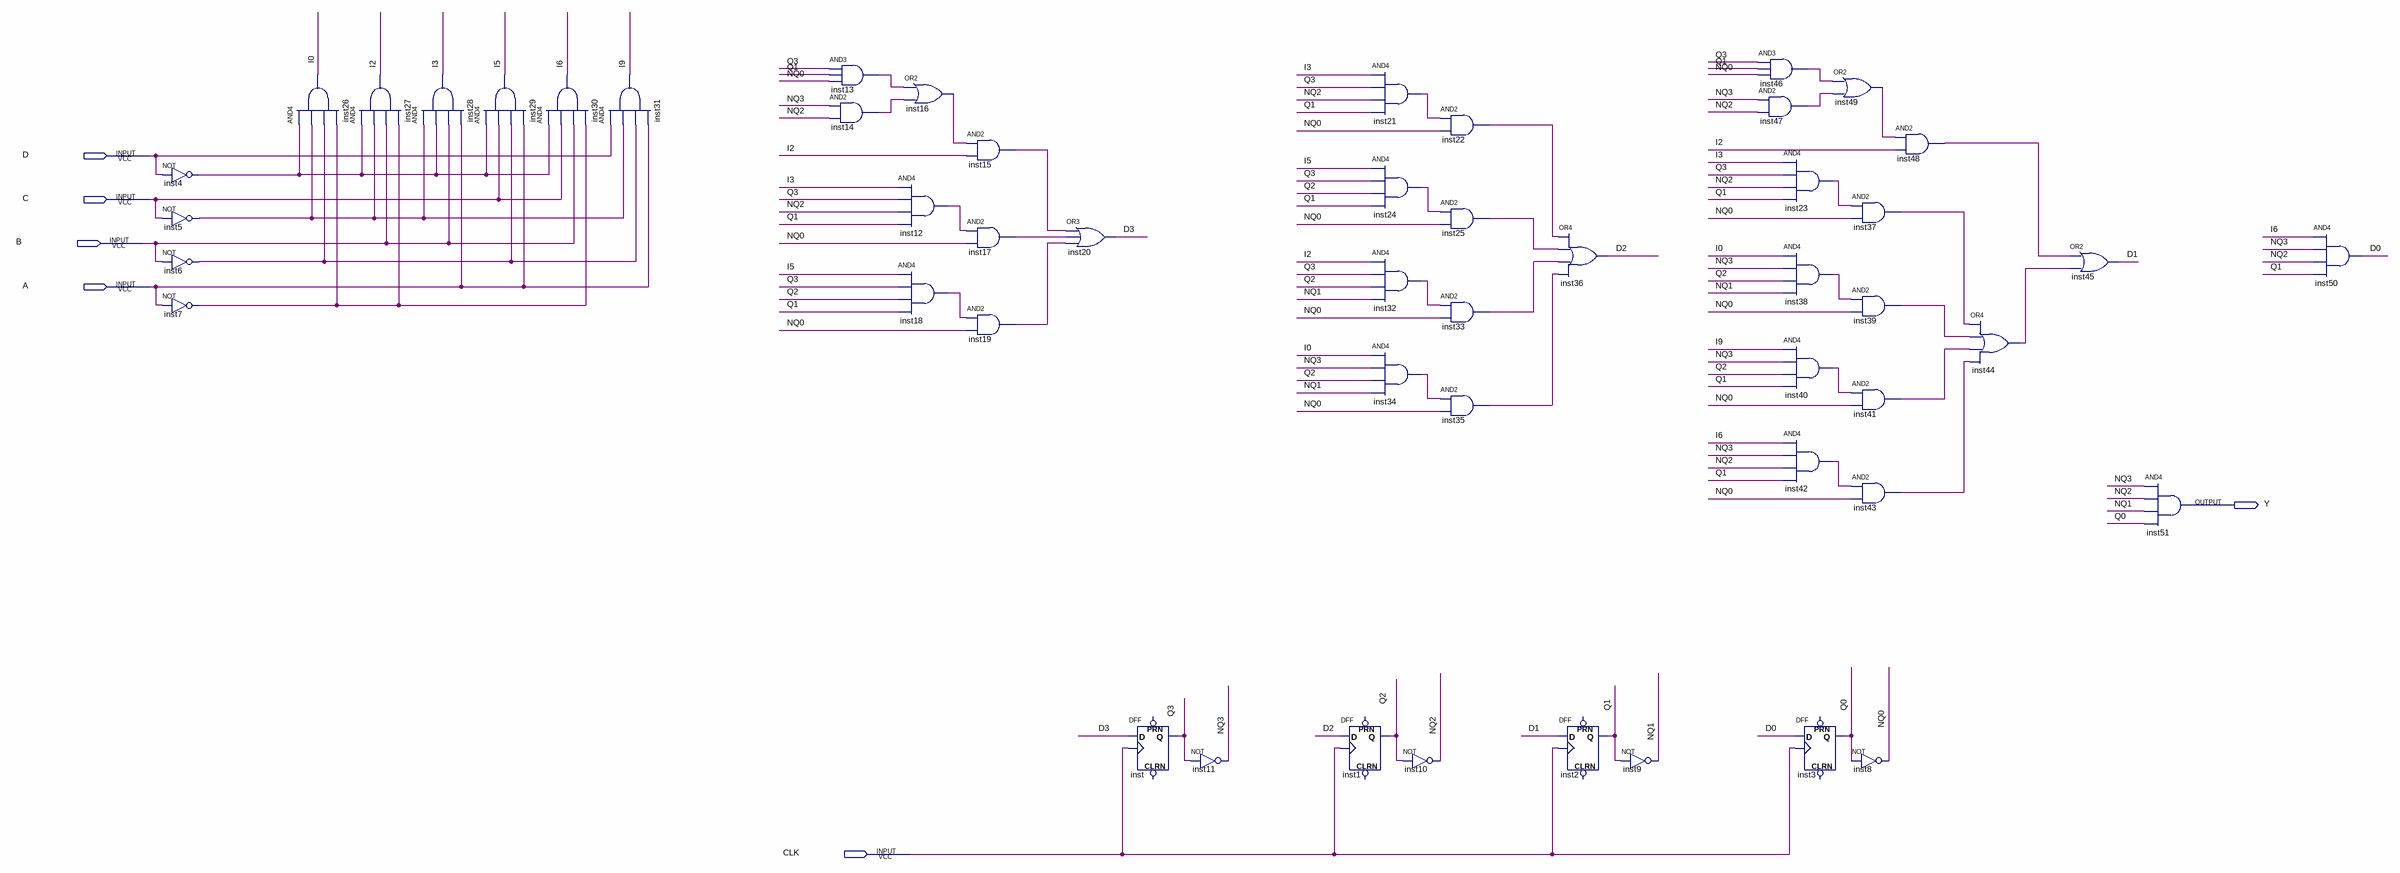
[diagram p0: schematic sheet]
// Quartus schematic MSSV.bdf as structural Verilog: 52 symbols, 6 pins
module MSSV (
  input  D,
  input  C,
  input  B,
  input  A,
  input  CLK,
  output Y
);

  wire D0, D1, D2, D3, I0, I2, I3, I5, I6, I9, inst4_out, inst5_out, inst6_out, inst7_out, inst12_out,
       inst13_out, inst14_out, inst15_out, inst16_out, inst17_out, inst18_out, inst19_out, inst21_out,
       inst22_out, inst23_out, inst24_out, inst25_out, inst32_out, inst33_out, inst34_out, inst35_out,
       inst37_out, inst38_out, inst39_out, inst40_out, inst41_out, inst42_out, inst43_out, inst44_out,
       inst46_out, inst47_out, inst48_out, inst49_out, NQ0, NQ1, NQ2, NQ3, Q0, Q1, Q2, Q3;

  not inst4 (inst4_out, D);
  not inst5 (inst5_out, C);
  not inst6 (inst6_out, B);
  not inst7 (inst7_out, A);
  and inst26 (I0, inst4_out, inst5_out, inst6_out, inst7_out);
  and inst27 (I2, inst4_out, inst5_out, B, inst7_out);
  and inst28 (I3, inst5_out, inst4_out, B, A);
  and inst29 (I5, inst4_out, C, inst6_out, A);
  and inst30 (I6, inst4_out, C, B, inst7_out);
  and inst31 (I9, D, inst5_out, inst6_out, A);
  and inst13 (inst13_out, Q3, Q1, NQ0);
  and inst14 (inst14_out, NQ3, NQ2);
  or inst16 (inst16_out, inst13_out, inst14_out);
  and inst12 (inst12_out, I3, Q3, NQ2, Q1);
  and inst18 (inst18_out, I5, Q3, Q2, Q1);
  and inst15 (inst15_out, inst16_out, I2);
  and inst17 (inst17_out, inst12_out, NQ0);
  and inst19 (inst19_out, inst18_out, NQ0);
  or inst20 (D3, inst15_out, inst17_out, inst19_out);
  DFF inst (.CLK(CLK), .D(D3), .Q(Q3));  // open: CLRN, PRN
  not inst11 (NQ3, Q3);
  DFF inst1 (.CLK(CLK), .D(D2), .Q(Q2));  // open: CLRN, PRN
  and inst21 (inst21_out, I3, Q3, NQ2, Q1);
  and inst24 (inst24_out, I5, Q3, Q2, Q1);
  and inst32 (inst32_out, I2, Q3, Q2, NQ1);
  and inst34 (inst34_out, I0, NQ3, Q2, NQ1);
  not inst10 (NQ2, Q2);
  and inst22 (inst22_out, inst21_out, NQ0);
  and inst25 (inst25_out, inst24_out, NQ0);
  and inst33 (inst33_out, inst32_out, NQ0);
  and inst35 (inst35_out, inst34_out, NQ0);
  or inst36 (D2, inst22_out, inst25_out, inst33_out, inst35_out);
  DFF inst2 (.CLK(CLK), .D(D1), .Q(Q1));  // open: CLRN, PRN
  not inst9 (NQ1, Q1);
  and inst46 (inst46_out, Q3, Q1, NQ0);
  and inst47 (inst47_out, NQ3, NQ2);
  and inst23 (inst23_out, I3, Q3, NQ2, Q1);
  and inst38 (inst38_out, I0, NQ3, Q2, NQ1);
  and inst40 (inst40_out, I9, NQ3, Q2, Q1);
  and inst42 (inst42_out, I6, NQ3, NQ2, Q1);
  DFF inst3 (.CLK(CLK), .D(D0), .Q(Q0));  // open: CLRN, PRN
  or inst49 (inst49_out, inst46_out, inst47_out);
  and inst37 (inst37_out, inst23_out, NQ0);
  and inst39 (inst39_out, inst38_out, NQ0);
  and inst41 (inst41_out, inst40_out, NQ0);
  and inst43 (inst43_out, inst42_out, NQ0);
  not inst8 (NQ0, Q0);
  and inst48 (inst48_out, inst49_out, I2);
  or inst44 (inst44_out, inst37_out, inst39_out, inst41_out, inst43_out);
  or inst45 (D1, inst48_out, inst44_out);
  and inst51 (Y, NQ3, NQ2, NQ1, Q0);
  and inst50 (D0, I6, NQ3, NQ2, Q1);
endmodule
